# EAGLE design left (EAGLE 9.5.1)
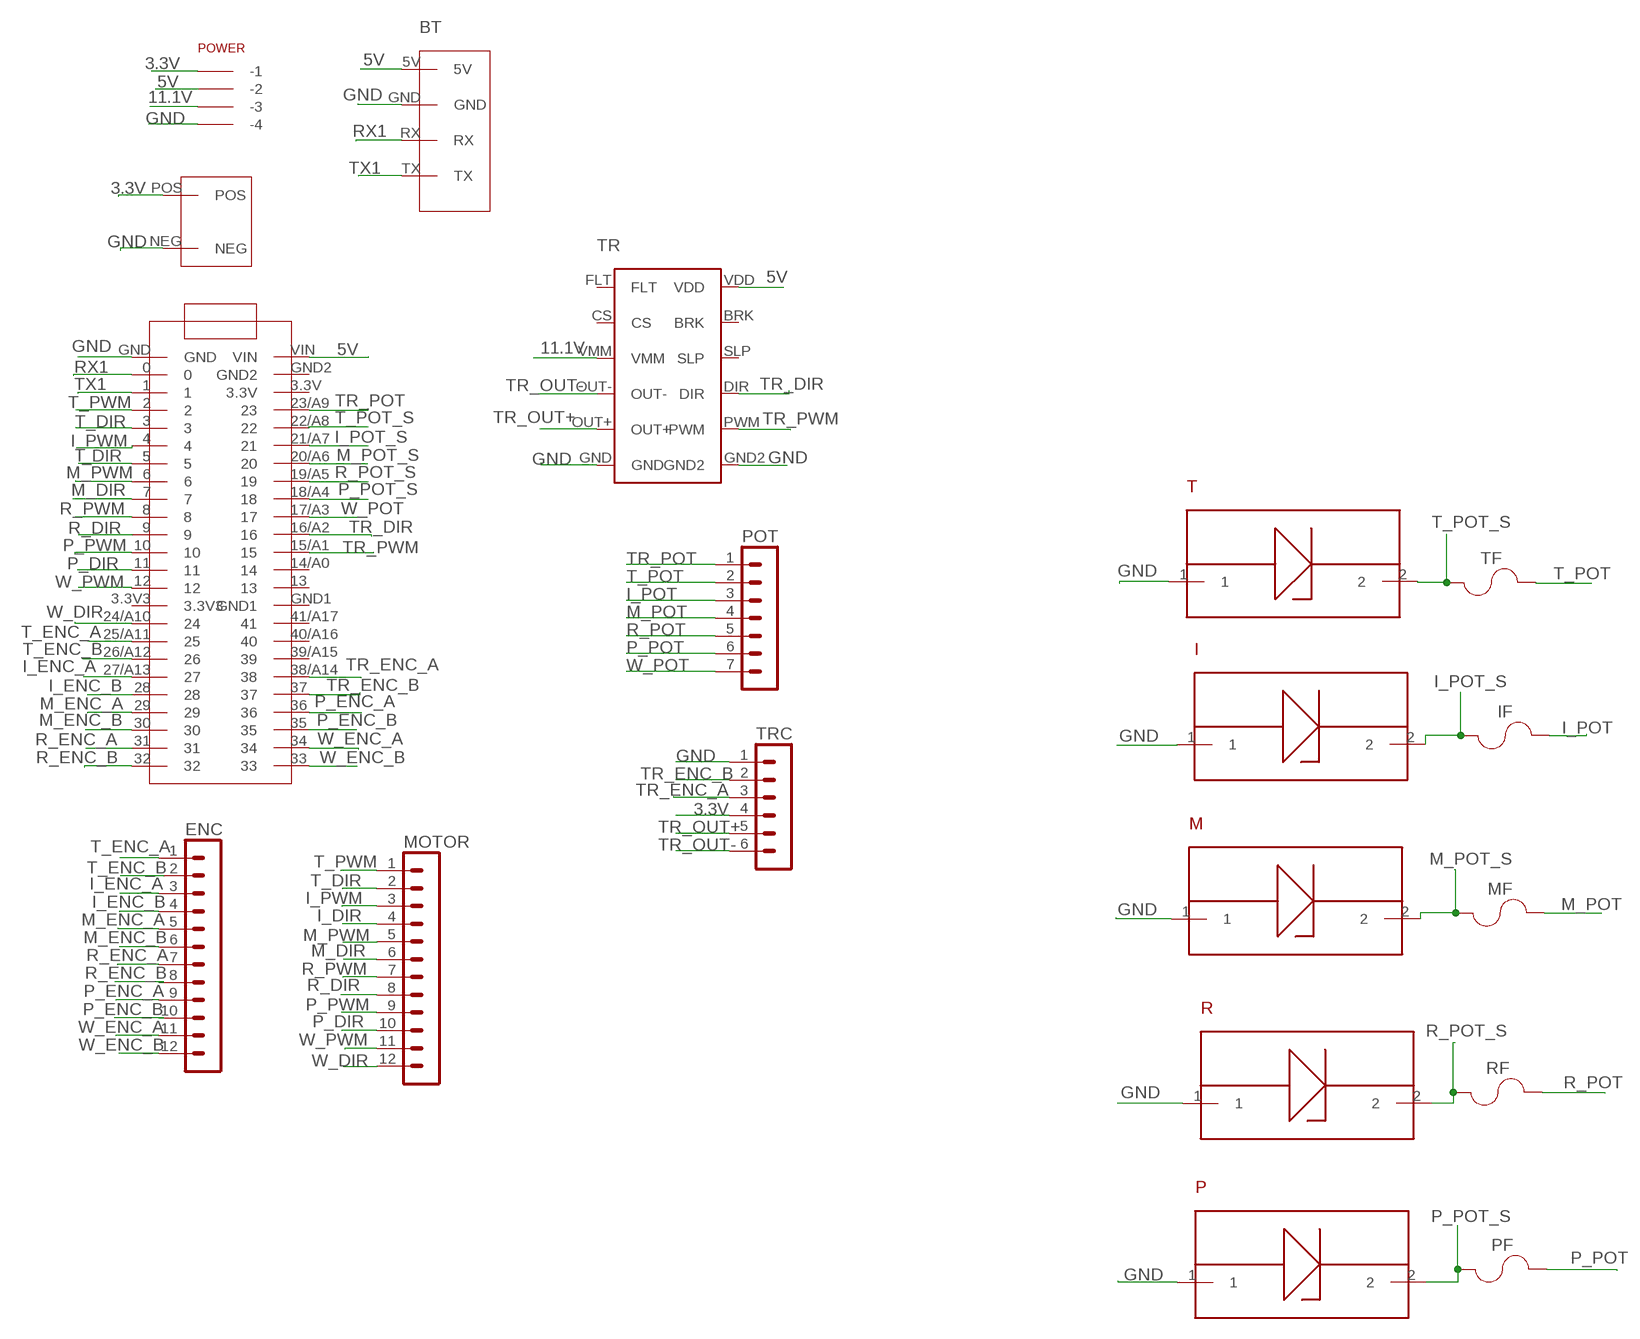
[diagram p0: schematic, sheet 1]

## Parts
4.1B  TEENSY_4.1_DIL  [TEENSY_4.1_DIL]
ANG  2  2_PIN_SMALL  [2_PIN_SMALL]
BT  2  4_PIN_SMALL  [4_PIN_SMALL]
ENC  53047-1210  [53047-1210]
I  BZX584C_ZENER_DIODE  [SOD-523]
IF  0805D  [0805]
M  BZX584C_ZENER_DIODE  [SOD-523]
MF  0805D  [0805]
MOTOR  53047-1210  [53047-1210]
P  BZX584C_ZENER_DIODE  [SOD-523]
PF  0805D  [0805]
POT  53047-0710  [53047-0710]
POWER  5267-4  [5267-4]
R  BZX584C_ZENER_DIODE  [SOD-523]
RF  0805D  [0805]
T  BZX584C_ZENER_DIODE  [SOD-523]
TF  0805D  [0805]
TR  DRV8801  [DRV8801]
TRC  53047-0610  [53047-0610]

## Nets
3.3V: ANG.POS POWER.P$1(-1) TRC.4
5V: 4.1B.VIN BT.5V POWER.P$2(-2) TR.VDD
11.1V: POWER.P$3(-3) TR.VMM
GND: 4.1B.GND ANG.NEG BT.GND I.1 M.1 P.1 POWER.P$4(-4) R.1 T.1 TR.GND TR.GND2 TRC.1
I_DIR: 4.1B.5 MOTOR.4
I_ENC_A: 4.1B.27/A13 ENC.3
I_ENC_B: 4.1B.28 ENC.4
I_POT: IF.2 POT.3
I_POT_S: 4.1B.21/A7 I.2 IF.1
I_PWM: 4.1B.4 MOTOR.3
M_DIR: 4.1B.7 MOTOR.6
M_ENC_A: 4.1B.29 ENC.5
M_ENC_B: 4.1B.30 ENC.6
M_POT: MF.2 POT.4
M_POT_S: 4.1B.20/A6 M.2 MF.1
M_PWM: 4.1B.6 MOTOR.5
P_DIR: 4.1B.11 MOTOR.10
P_ENC_A: 4.1B.36 ENC.9
P_ENC_B: 4.1B.35 ENC.10
P_POT: PF.2 POT.6
P_POT_S: 4.1B.18/A4 P.2 PF.1
P_PWM: 4.1B.10 MOTOR.9
R_DIR: 4.1B.9 MOTOR.8
R_ENC_A: 4.1B.31 ENC.7
R_ENC_B: 4.1B.32 ENC.8
R_POT: POT.5 RF.2
R_POT_S: 4.1B.19/A5 R.2 RF.1
R_PWM: 4.1B.8 MOTOR.7
RX1: 4.1B.0 BT.RX
T_DIR: 4.1B.3 MOTOR.2
T_ENC_A: 4.1B.25/A11 ENC.1
T_ENC_B: 4.1B.26/A12 ENC.2
T_POT: POT.2 TF.2
T_POT_S: 4.1B.22/A8 T.2 TF.1
T_PWM: 4.1B.2 MOTOR.1
TR_DIR: 4.1B.16/A2 TR.DIR
TR_ENC_A: 4.1B.38/A14 TRC.3
TR_ENC_B: 4.1B.37 TRC.2
TR_OUT+: TR.OUT+ TRC.5
TR_OUT-: TR.OUT- TRC.6
TR_POT: 4.1B.23/A9 POT.1
TR_PWM: 4.1B.15/A1 TR.PWM
TX1: 4.1B.1 BT.TX
W_DIR: 4.1B.24/A10 MOTOR.12
W_ENC_A: 4.1B.34 ENC.11
W_ENC_B: 4.1B.33 ENC.12
W_POT: 4.1B.17/A3 POT.7
W_PWM: 4.1B.12 MOTOR.11
Unconnected: 4.1B.3.3V 4.1B.3.3V3 4.1B.13 4.1B.14/A0 4.1B.39/A15 4.1B.40/A16 4.1B.41/A17 4.1B.GND1 4.1B.GND2 TR.BRK TR.CS TR.FLT TR.SLP

## Library data of the parts
4.1B = Teensy4.1 - back:TEENSY_4.1_DIL
ANG = diy:2_PIN_SMALL
BT = diy:4_PIN_SMALL
ENC MOTOR = con-molex-picoblade:53047-1210: HEADER
I M P R T = diy:BZX584C_ZENER_DIODE
IF MF PF RF TF = SparkFun-Fuses:0805D
POT = con-molex-picoblade:53047-0710: HEADER
POWER = con-molex-spox:5267-4
TR = DRV8801:DRV8801
TRC = con-molex-picoblade:53047-0610: HEADER

## Board
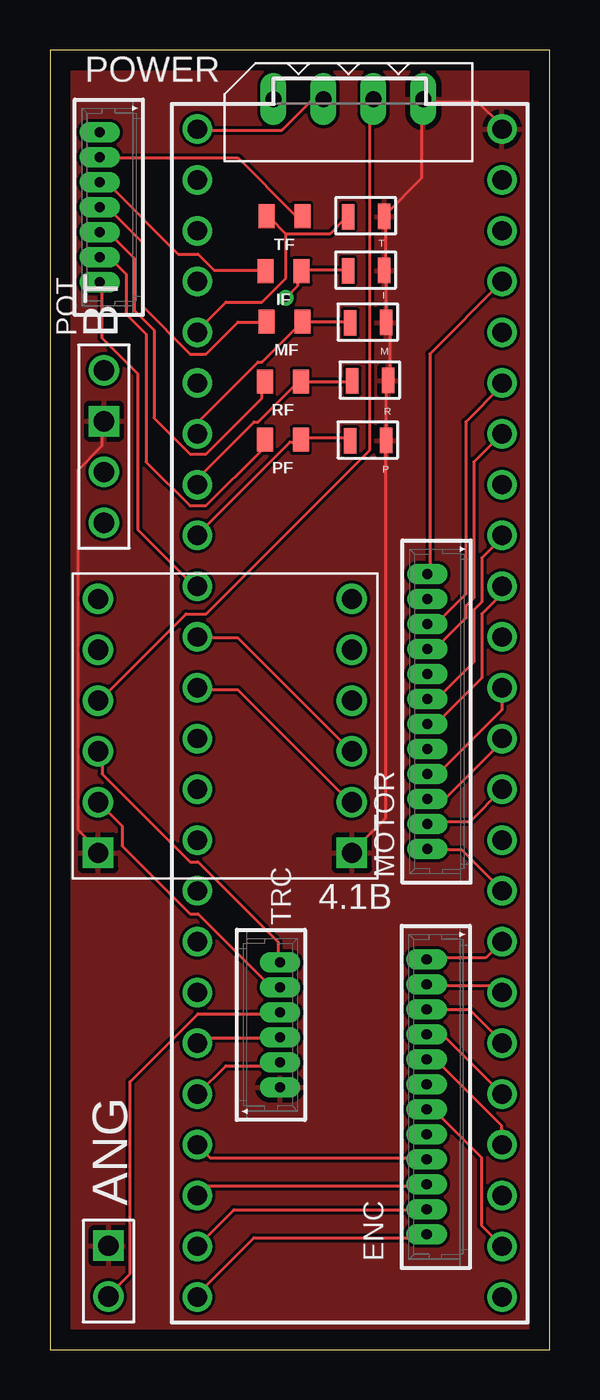
[diagram p1: board, top side]
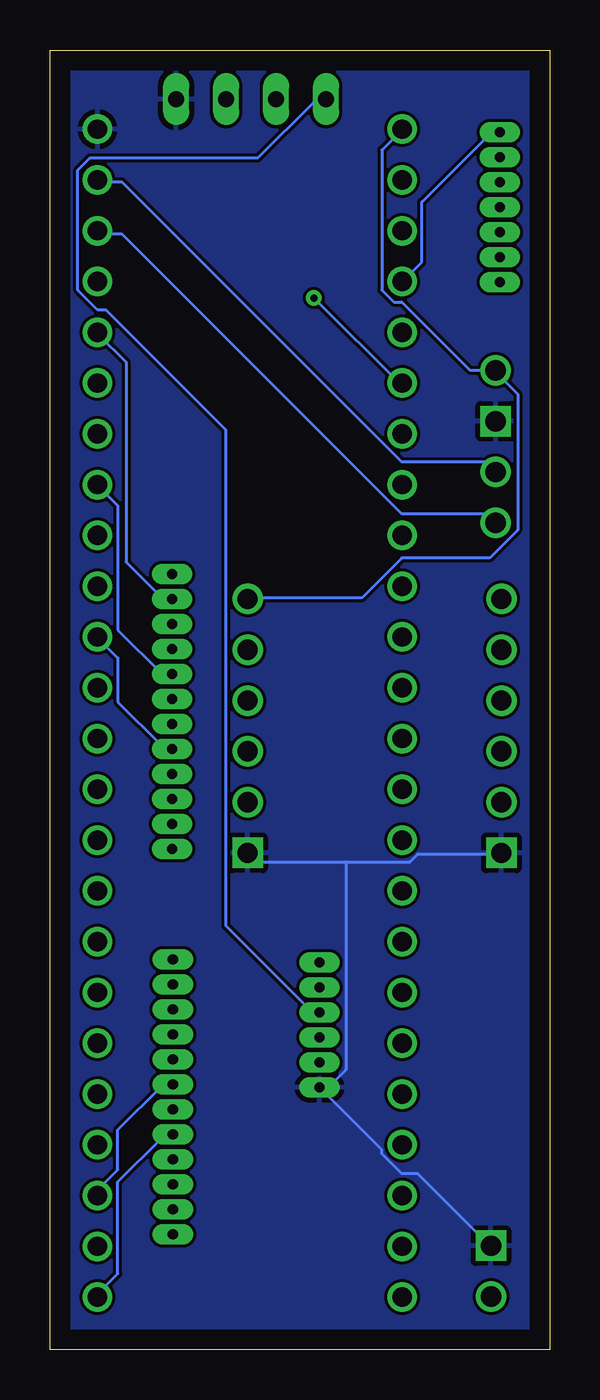
[diagram p2: board, bottom side, seen from below]

Size 25 x 65 mm. Coordinates in mm from the lower left corner, seen from the top.
Outline: 0,0 25,0 25,65 0,65 0,0
Copper layers (1*16): Top 0.035mm / dielectric 1.5mm / Bottom 0.035mm
Design rules "default": minimum track width 6mil, minimum drill 0.35mm, track to track 6mil, track to pad 6mil, pad to pad 6mil, via to via 6mil, smd to smd 6mil, copper to edge 40mil, drill to drill 6mil, minimum pad ring 10mil, minimum via ring 8mil, stop-mask expansion 4mil, vias tented up to drill 0mil, thermal gap 10mil

### Footprints (pad centres in the part's own frame; a part is rotated, then mirrored left to right if it is on the bottom)
TEENSY_4.1_DIL = drill 0.965: 0 7.62,25.4; 1 7.62,22.86; 2 7.62,20.32; 3 7.62,17.78; 3.3V -7.62,22.86; 3.3V3 7.62,-7.62; 4 7.62,15.24; 5 7.62,12.7; 6 7.62,10.16; 7 7.62,7.62; 8 7.62,5.08; 9 7.62,2.54; 10 7.62,0; 11 7.62,-2.54; 12 7.62,-5.08; 13 -7.62,-5.08; 14/A0 -7.62,-2.54; 15/A1 -7.62,0; 16/A2 -7.62,2.54; 17/A3 -7.62,5.08; 18/A4 -7.62,7.62; 19/A5 -7.62,10.16; 20/A6 -7.62,12.7; 21/A7 -7.62,15.24; 22/A8 -7.62,17.78; 23/A9 -7.62,20.32; 24/A10 7.62,-10.16; 25/A11 7.62,-12.7; 26/A12 7.62,-15.24; 27/A13 7.62,-17.78; 28 7.62,-20.32; 29 7.62,-22.86; 30 7.62,-25.4; 31 7.62,-27.94; 32 7.62,-30.48; 33 -7.62,-30.48; 34 -7.62,-27.94; 35 -7.62,-25.4; 36 -7.62,-22.86; 37 -7.62,-20.32; 38/A14 -7.62,-17.78; 39/A15 -7.62,-15.24; 40/A16 -7.62,-12.7; 41/A17 -7.62,-10.16; GND 7.62,27.94; GND1 -7.62,-7.62; GND2 -7.62,25.4; VIN -7.62,27.94
2_PIN_SMALL = drill 1.016 square: NEG 0,-1.27 | drill 1.016: POS 0,1.27
4_PIN_SMALL = drill 1.016: 5V 0,1.27; RX 0,-3.81; TX 0,-6.35 | drill 1.016 square: GND 0,-1.27
53047-1210 = drill 0.508 long: 1 6.875,0; 2 5.625,0; 3 4.375,0; 4 3.125,0; 5 1.875,0; 6 0.625,0; 7 -0.625,0; 8 -1.875,0; 9 -3.125,0; 10 -4.375,0; 11 -5.625,0; 12 -6.875,0
SOD-523 = smd 0.635 x 1.27: 1 -1.13,0.03; 2 0.68,0.05
0805 = smd 0.8 x 1.2: 1 -0.9,0; 2 0.9,0
53047-0710 = drill 0.508 long: 1 3.75,0; 2 2.5,0; 3 1.25,0; 4 0,0; 5 -1.25,0; 6 -2.5,0; 7 -3.75,0
5267-4 = drill 0.8 long: P$1 0,0; P$2 2.5,0; P$3 5,0; P$4 7.5,0
DRV8801 = drill 1.016: BRK 6.35,3.81; CS -6.35,3.81; DIR 6.35,-1.27; FLT -6.35,6.35; OUT+ -6.35,-3.81; OUT- -6.35,-1.27; PWM 6.35,-3.81; SLP 6.35,1.27; VDD 6.35,6.35; VMM -6.35,1.27 | drill 1.016 square: GND -6.35,-6.35; GND2 6.35,-6.35
53047-0610 = drill 0.508 long: 1 3.125,0; 2 1.875,0; 3 0.625,0; 4 -0.625,0; 5 -1.875,0; 6 -3.125,0

### Placement (x,y rotation side)
4.1B  15,33.1 0 top
ANG  2.93,3.92 180 top
BT  2.7,47.7 0 top
ENC  18.85,12.63 90 top
I  15.6,54 180 top
IF  11.69,53.93 180 top
M  15.7,51.4 180 top
MF  11.74,51.41 180 top
MOTOR  18.89,31.91 90 top
P  15.7,45.5 180 top
PF  11.65,45.51 180 top
POT  2.49,57.13 90 top
POWER  11.18,62.55 0 top
R  15.8,48.5 180 top
RF  11.66,48.41 180 top
T  15.6,56.7 180 top
TF  11.73,56.69 0 top
TR  8.76,31.19 0 top
TRC  11.51,16.24 270 top

### Tracks (layer width: path | path; a pad name or v marks a point on that pad's centre or on a via)
3.3V
  Top 0.152: TRC.4 11.4,16.8 7.4,16.8 4,13.4 4,3.8 3,2.8 ANG.POS
  Bottom 0.152: POWER.P$1 11.2,62.4 11.8,62.4 14.6,59.6 23,59.6 23.6,59 23.6,53 22.6,52 22.2,52 16.2,46 16.2,21.2 12,17 11.6,17 TRC.4
5V
  Top 0.152: POWER.P$2 13.6,62.4 13,62.4 11.6,61 7.4,61 4.1B.VIN
  Bottom 0.152: 4.1B.VIN 7.4,61 8.4,60 8.4,53 7.8,52.4 7.4,52.4 4,49 2.8,49 BT.5V 2.6,48.8 1.6,47.8 1.6,41 3,39.6 7.4,39.6 9.4,37.6 15,37.6 TR.VDD
11.1V
  Top 0.152: POWER.P$3 16,62.4 16,45 7.8,36.8 6.8,36.8 2.6,32.6 TR.VMM
GND
  Top 0.152: 4.1B.GND 22.6,61.2 21.4,62.4 18.8,62.4 POWER.P$4 18.6,62.4 18.6,58.6 16.8,56.8 T.1 16.8,56.6 16.8,54 I.1 16.8,53.8 16.8,51.4 M.1 17,51.2 17,48.6 R.1 16.8,48.4 16.8,45.6 P.1 16.8,45.4 16.8,26.6 15.2,25 TR.GND2 | BT.GND 2.6,46.4 2.6,45.2 1.4,44 1.4,26 2.4,25 TR.GND
  Bottom 0.152: ANG.NEG 3,5.2 6.6,8.8 7.4,8.8 8.4,9.8 8.4,10 11.4,13 TRC.1 11.4,13.2 11,13.2 10.2,14 10.2,24.4 | 10.2,24.4 14.6,24.4 15,24.8 TR.GND2 | 10.2,24.4 7,24.4 6.6,24.8 2.6,24.8 TR.GND
  pour Top: -4.8,69 -4.8,-4.5 33.3,-4.5 33.3,69
  pour Bottom: -11,72.1 -11,-9.8 41.2,-9.8 41.2,72.1
I_DIR
  Top 0.152: MOTOR.4 19,35.2 19.4,35.2 20.8,36.6 20.8,37.2 21.2,37.6 21.2,44.4 22.6,45.8 4.1B.5
I_ENC_A
  Top 0.152: ENC.3 19,17 21,17 22.6,15.4 4.1B.27/A13
I_ENC_B
  Top 0.152: 4.1B.28 19.8,15.6 19,15.6 ENC.4
I_POT
  Top 0.152: IF.2 10.6,54 8.2,54 7.4,54.8 6.4,54.8 3,58.2 2.6,58.2 POT.3
I_POT_S  (via drill 0.35)
  Top 0.152: I.2 14.8,54 12.6,54 IF.1 12.4,53.8 12.4,53.2 v11.8,52.6
  Bottom 0.152: v11.8,52.6 7.4,48.2 4.1B.21/A7
I_PWM
  Top 0.152: MOTOR.3 19,36.4 19.4,36.4 20.8,37.8 20.8,46.4 22.6,48.2 4.1B.4
M_DIR
  Top 0.152: MOTOR.6 19,32.6 19.4,32.6 21.2,34.4 21.2,37 21.6,37.4 21.6,39.6 22.6,40.6 4.1B.7
M_ENC_A
  Top 0.152: ENC.5 19,14.4 19.4,14.4 22.6,11.2 22.6,10.4 4.1B.29
M_ENC_B
  Bottom 0.152: ENC.6 19,13.2 19.4,13.2 21.6,11 21.6,9 22.8,7.8 4.1B.30
M_POT
  Top 0.152: MF.2 10.8,51.4 9.4,51.4 7.8,49.8 7,49.8 4.6,52.2 4.6,55.4 3,57 2.6,57 POT.4
M_POT_S
  Top 0.152: M.2 15,51.4 12.8,51.4 MF.1 12.6,51.4 10.6,49.4 10.4,49.4 7.4,46.4 7.4,45.8 4.1B.20/A6
M_PWM
  Bottom 0.152: MOTOR.5 19,33.8 19.4,33.8 21.6,36 21.6,42.2 22.6,43.2 4.1B.6
P_DIR
  Top 0.152: MOTOR.10 19,27.6 19.8,27.6 22.6,30.4 4.1B.11
P_ENC_A
  Top 0.152: ENC.9 18.8,9.6 8,9.6 7.4,10.2 4.1B.36
P_ENC_B
  Top 0.152: ENC.10 18.8,8.2 7.8,8.2 7.4,7.8 4.1B.35
P_POT
  Top 0.152: PF.2 10.6,45.4 10.6,45 7.8,42.2 7,42.2 4.8,44.4 4.8,50.8 3.8,51.8 3.8,53.8 3,54.6 2.6,54.6 POT.6
P_POT_S
  Top 0.152: P.2 15,45.6 12.6,45.6 PF.1 12.4,45.4 12,45.4 7.4,40.8 4.1B.18/A4
P_PWM
  Top 0.152: MOTOR.9 19,28.8 19.4,28.8 22.6,32 22.6,33 4.1B.10
R_DIR
  Bottom 0.152: MOTOR.8 19,30.2 19.4,30.2 21.6,32.4 21.6,34.6 22.6,35.6 4.1B.9
R_ENC_A
  Top 0.152: ENC.7 19,12 19.4,11.6 19.6,11.6 21.6,9.6 21.6,6.2 22.6,5.2 4.1B.31
R_ENC_B
  Bottom 0.152: ENC.8 19,10.6 19.4,10.6 21.6,8.4 21.6,3.8 22.6,2.8 4.1B.32
R_POT
  Top 0.152: RF.2 10.6,48.4 10.6,47.6 7.8,44.8 7,44.8 5.2,46.6 5.2,51 4.2,52 4.2,54.6 3,55.8 2.6,55.8 POT.5
R_POT_S
  Top 0.152: R.2 15,48.4 12.6,48.4 RF.1 12.4,48.4 10.4,46.4 10.2,46.4 7.2,43.4 4.1B.19/A5
R_PWM
  Top 0.152: MOTOR.7 19,31.4 19.4,31.4 21.6,33.6 21.6,36.8 22.8,38 4.1B.8
RX1
  Bottom 0.152: 4.1B.0 22.6,58.4 21.4,58.4 7.4,44.4 3.2,44.4 2.8,44 BT.RX
T_DIR
  Bottom 0.152: MOTOR.2 19,37.6 19.4,37.6 21.2,39.4 21.2,49.4 22.6,50.8 4.1B.3
T_ENC_A
  Top 0.152: ENC.1 19,19.6 21.8,19.6 22.6,20.4 4.1B.25/A11
T_ENC_B
  Top 0.152: ENC.2 19,18.2 22.4,18.2 22.6,18 4.1B.26/A12
T_POT
  Top 0.152: TF.2 12.6,56.8 12.2,56.8 9.4,59.6 2.6,59.6 POT.2
T_POT_S
  Top 0.152: 11.8,55.8 11,56.6 TF.1 | 11.8,55.8 14,55.8 14.8,56.6 T.2 | 11.8,55.8 11.8,53.6 10.6,52.4 8.8,52.4 7.4,51 4.1B.22/A8
T_PWM
  Top 0.152: 4.1B.2 19,49.8 19,38.8 MOTOR.1
TR_DIR
  Top 0.152: 4.1B.16/A2 7.4,35.6 9.4,35.6 15,30 TR.DIR
TR_ENC_A
  Top 0.152: TRC.3 11.4,15.6 7.6,15.6 7.4,15.4 4.1B.38/A14
TR_ENC_B
  Top 0.152: 4.1B.37 8.8,14.2 11.4,14.2 TRC.2
TR_OUT+
  Top 0.152: TRC.5 11.4,18.2 11,18.2 7.4,21.8 7,21.8 3.6,25.2 3.6,26.2 2.6,27.2 TR.OUT+
TR_OUT-
  Top 0.152: TRC.6 11.4,19.4 11.4,20.4 7.4,24.4 7,24.4 2.6,28.8 2.6,29.8 TR.OUT-
TR_POT
  Bottom 0.152: 4.1B.23/A9 6.4,54.4 6.4,57.4 3,60.8 2.6,60.8 POT.1
TR_PWM
  Top 0.152: 4.1B.15/A1 7.4,33 9.4,33 15,27.4 TR.PWM
TX1
  Bottom 0.152: 4.1B.1 22.6,55.8 21.4,55.8 7.4,41.8 3.2,41.8 2.8,41.4 BT.TX
W_DIR
  Top 0.152: MOTOR.12 19,25 20.6,25 22.6,23 4.1B.24/A10
W_ENC_A
  Top 0.152: ENC.11 18.8,7 9.2,7 7.4,5.2 4.1B.34
W_ENC_B
  Top 0.152: ENC.12 18.8,5.6 10.2,5.6 7.4,2.8 4.1B.33
W_POT
  Top 0.152: POT.7 2.6,53.2 2.6,50.6 4.4,48.8 4.4,41 7.2,38.2 4.1B.17/A3
W_PWM
  Top 0.152: 4.1B.12 21,26.4 19,26.4 MOTOR.11